# EasyEDA Pro project 第十五届蓝桥杯EDA赛项模拟试题一（嘉立创EDA提供）.eprj

# Schematic Schematic1
Create Date: 2024-01-25; Page Name: P1; Project Name: 【2024年蓝桥杯模拟试题】基于CW32的简易游戏机-EDA提供; Schematic Name: Schematic1; Update Date: 2024-01-25; Company: 深圳嘉立创科技集团股份有限公司; Drawed: 嘉立创EDA; Page Size: A4; Part Number: JLC-PCB-002; Reviewed: 嘉立创EDA; Version: V1.0
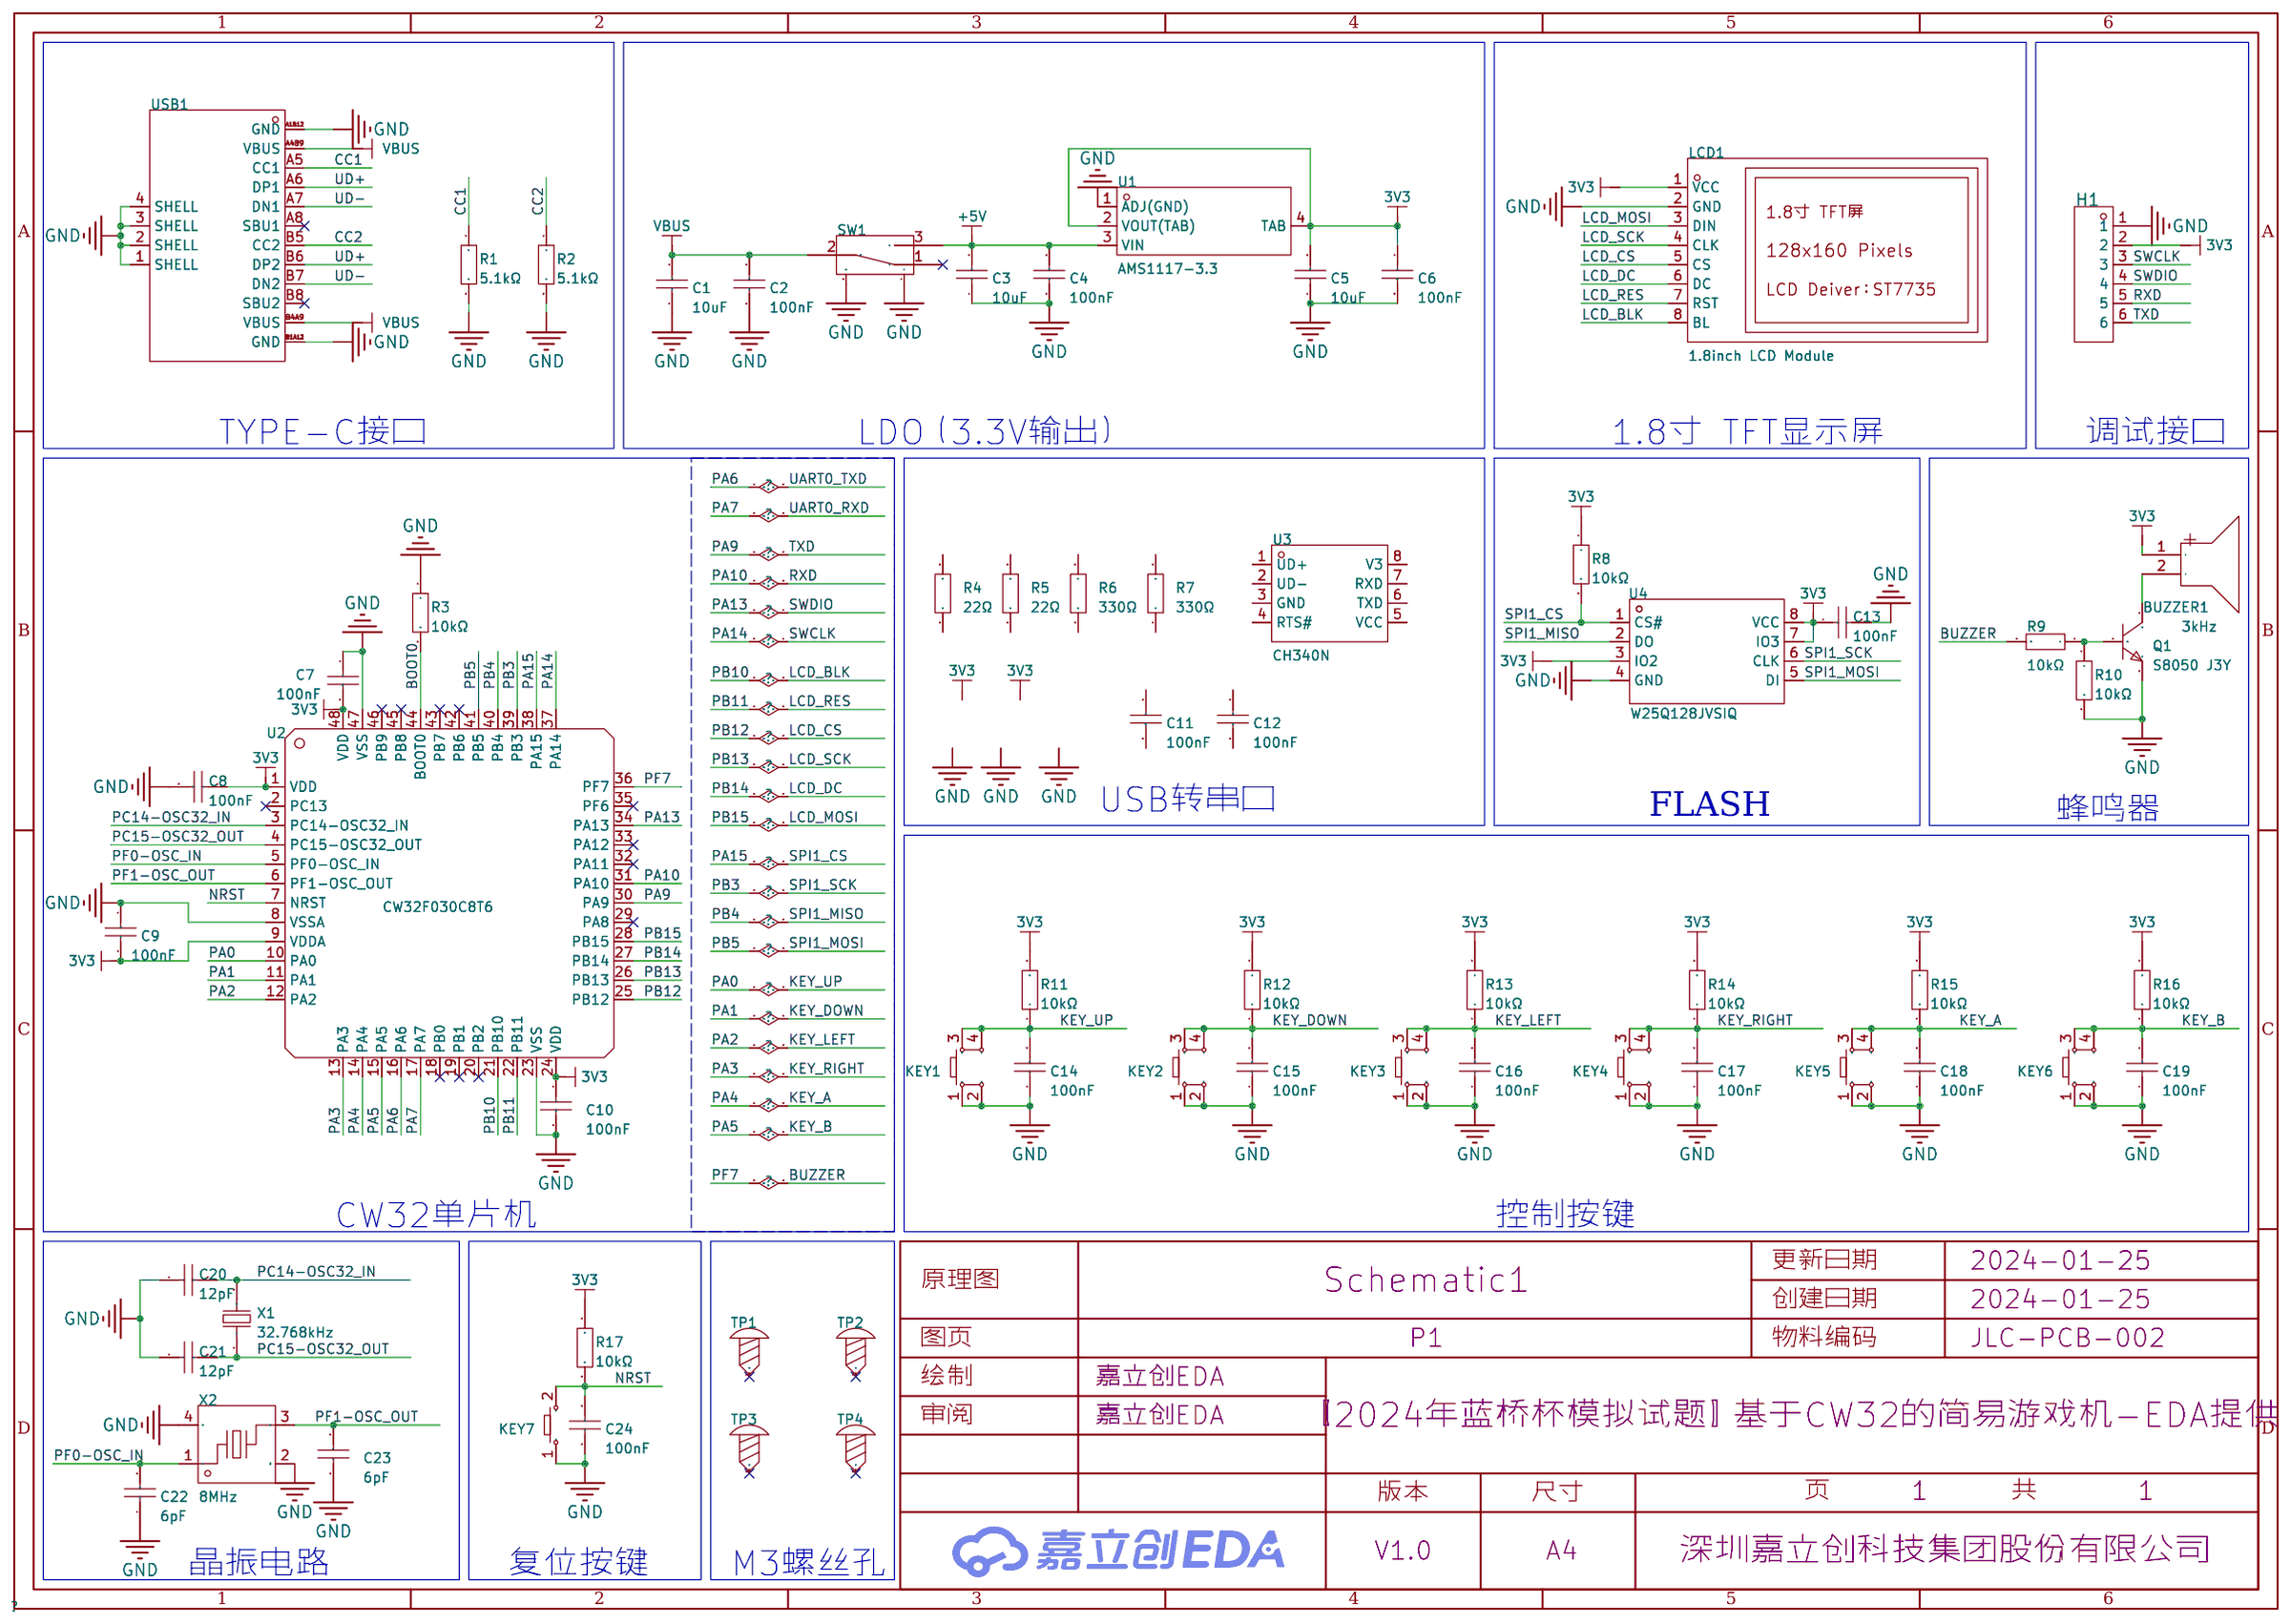
[diagram p0: schematic sheet]

## Parts
BUZZER1  3kHz  [BUZ-TH_BD9.0-P5.00-D0.6-FD]
C1  10uF  [C0805]
C2  100nF  [C0805]
C3  10uF  [C0805]
C4  100nF  [C0805]
C5  10uF  [C0805]
C6  100nF  [C0805]
C7  100nF  [C0805]
C8  100nF  [C0805]
C9  100nF  [C0805]
C10  100nF  [C0805]
C11  100nF  [C0805]
C12  100nF  [C0805]
C13  100nF  [C0805]
C14  100nF  [C0805]
C15  100nF  [C0805]
C16  100nF  [C0805]
C17  100nF  [C0805]
C18  100nF  [C0805]
C19  100nF  [C0805]
C20  12pF  [C0805]
C21  12pF  [C0805]
C22  6pF  [C0805]
C23  6pF  [C0805]
C24  100nF  [C0805]
H1  PZ254V-11-06P  [HDR-TH_6P-P2.54-V-M]
KEY1  -  [SW-SMD_4P-L6.0-W6.0-P4.50-LS9.0-2]
KEY2  -  [SW-SMD_4P-L6.0-W6.0-P4.50-LS9.0-2]
KEY3  -  [SW-SMD_4P-L6.0-W6.0-P4.50-LS9.0-2]
KEY4  -  [SW-SMD_4P-L6.0-W6.0-P4.50-LS9.0-2]
KEY5  -  [SW-SMD_4P-L6.0-W6.0-P4.50-LS9.0-2]
KEY6  -  [SW-SMD_4P-L6.0-W6.0-P4.50-LS9.0-2]
KEY7  -  [Key_SMD_3.6x6.1x2.5]
LCD1  1.8inch LCD Module  [LCD-TH_L56.5-W34.0_1-8INCH-LCD-MODULE]
Q1  S8050 J3Y  [SOT-23-3_L3.0-W1.7-P0.95-LS2.9-BR]
R1  5.1kΩ  [R0805]
R2  5.1kΩ  [R0805]
R3  10kΩ  [R0805]
R4  22Ω  [R0805]
R5  22Ω  [R0805]
R6  330Ω  [R0805]
R7  330Ω  [R0805]
R8  10kΩ  [R0805]
R9  10kΩ  [R0805]
R10  10kΩ  [R0805]
R11  10kΩ  [R0805]
R12  10kΩ  [R0805]
R13  10kΩ  [R0805]
R14  10kΩ  [R0805]
R15  10kΩ  [R0805]
R16  10kΩ  [R0805]
R17  10kΩ  [R0805]
SW1  SK-12E12-G5  [SW-TH_SK-12E12-G5]
TP1  -  [M3螺丝]
TP2  -  [M3螺丝]
TP3  -  [M3螺丝]
TP4  -  [M3螺丝]
U1  AMS1117-3.3  [SOT-223-4_L6.5-W3.5-P2.30-LS7.0-BR]
U2  CW32F030C8T6  [LQFP-48_L7.0-W7.0-P0.50-LS9.0-TL]
U3  CH340N  [SOP-8_L4.9-W3.9-P1.27-LS6.0-BL]
U4  W25Q128JVSIQ  [SOIC-8_L5.3-W5.3-P1.27-LS8.0-BL]
USB1  TYPE-C 16PIN 3MD(385)  [USB-C-SMD_TYPE-C16PIN]
X1  32.768kHz  [FC-135R_L3.2-W1.5]
X2  8MHz  [OSC-SMD_4P-L3.2-W2.5-BL]

## Library data of the parts
BUZZER1 = HNB09A03: 驱动方式:有源(内含驱动线路);构造类型:电磁式;额定电压:3V;工作电压:1.5V~4.5V;消耗电流:30mA;频率:3kHz;声压(SPL):85dB@10cm;直径(φD):9mm;长度:-;宽度:-;高度:5.5mm;工作温度:-20℃~+70℃;; LCSC Part Name: 电磁式有源一体蜂鸣器HNB09A03; Supplier Part: C96102; Manufacturer: 华能; Supplier Footprint: 插件,D=9mm; Datasheet: https://atta.szlcsc.com/upload/public/pdf/source/20170522/1495448326172.pdf; Supplier: LCSC; Oscillator Circuit: 有源(内含驱动线路); Technology Type: 电磁式; Rated Voltage: 3V; Operating Voltage: 1.5V~4.5V; Current Consumption: 30mA; Sound Pressure Level (SPL): 85dB@10cm; Diameter (φD): 9mm; Height: 5.5mm; Operating Temperature: -20℃~+70℃
C1 C3 C5 = CL21A106KAYNNNE_C15850: 容值:10uF;精度:±10%;额定电压:25V;材质(温度系数):X5R;; LCSC Part Name: 10uF ±10% 25V; Supplier Part: C15850; Manufacturer: SAMSUNG(三星); Manufacturer Part: CL21A106KAYNNNE; Supplier Footprint: 0805; Datasheet: https://atta.szlcsc.com/upload/public/pdf/source/20160103/1457707679302.pdf; Supplier: LCSC; Tolerance: ±10%; Voltage Rated: 25V; Temperature Coefficient: X5R
C2 C4 C6-C19 C24 = CL21B104KBCNNNC: 容值:100nF;精度:±10%;额定电压:50V;材质(温度系数):X7R;; LCSC Part Name: 100nF ±10% 50V; Supplier Part: C1711; Manufacturer: SAMSUNG(三星); Supplier Footprint: 0805; Datasheet: https://atta.szlcsc.com/upload/public/pdf/source/20160218/1457707763339.pdf; Supplier: LCSC; Tolerance: ±10%; Voltage Rated: 50V; Temperature Coefficient: X7R
C20 C21 = 0805CG120J500NT: 容值:12pF;精度:±5%;额定电压:50V;材质(温度系数):C0G;; LCSC Part Name: 12pF ±5% 50V; Supplier Part: C1792; Manufacturer: FH(风华); Supplier Footprint: 0805; Datasheet: https://atta.szlcsc.com/upload/public/pdf/source/20200305/C486355_26A10D38EF8C2A5C37091D0039909270.pdf; Supplier: LCSC; Tolerance: ±5%; Voltage Rated: 50V; Temperature Coefficient: C0G
C22 C23 = 0805CG6R0C500NT: 容值:6pF;额定电压:50V;材质(温度系数):C0G;; LCSC Part Name: 6pF 50V ±0.25pF; Supplier Part: C67560; Manufacturer: FH(风华); Supplier Footprint: 0805; JLCPCB Part Class: 扩展库; Datasheet: https://atta.szlcsc.com/upload/public/pdf/source/20200305/C486355_26A10D38EF8C2A5C37091D0039909270.pdf; Supplier: LCSC; Voltage Rated: 50V; Temperature Coefficient: C0G
H1 = PZ254V-11-06P: 排数:单排;总PIN位数:6;间距:2.54mm;插针结构:1x6P;行距:-;安装类型:直插;圆针/方针:方针;额定电流:-;额定电压:-;配合针长度:6mm;塑高:2.5mm;端接针长度:3mm;触头材质:黄铜;触头镀层:-;工作温度范围:-40℃~+105℃;颜色:黑色;; LCSC Part Name: 2.54mm 1x6P 直插 方针; Supplier Part: C492405; Manufacturer: XFCN(兴飞); Supplier Footprint: 直插,P=2.54mm; JLCPCB Part Class: 扩展库; Supplier: LCSC; Number of Rows: 单排; Number of Pins: 6; Pitch: 2.54mm; Pin Structure: 1x6P; Mounting Type: 直插; Circluar Pins/Square Pins: 方针; Length of Mating Pin: 6mm; Insulation Height: 2.5mm; Length of End Connection Pin: 3mm; Contact Material: 黄铜; Operating Temperature Range: -40℃~+105℃; Color: 黑色
KEY1-KEY6 = Key_SMD_6x6x6.5: Supplier Footprint: SMD
KEY7 = Key_SMD_3.6x6.1x2.5: Supplier Footprint: SMD
LCD1 = 1.8inch LCD Module: 主控芯片:ST7735S;尺寸(inch):1.8;; LCSC Part Name: 树莓派 1.8寸LCD 迷你显示屏 扩展板 SPI接口 支持Arduino; Supplier Part: C359940; Manufacturer: Waveshare(微雪电子); Datasheet: https://atta.szlcsc.com/upload/public/pdf/source/20190107/C359940_B08D95A5D16FFF3D67403C4EC320696B.pdf; Supplier: LCSC; Main Control Chip: ST7735S; Size: 1.8
Q1 = S8050 J3Y_C2146: 晶体管类型:NPN;集射极击穿电压(Vceo):25V;集电极电流(Ic):500mA;功率(Pd):300mW;直流电流增益(hFE@Ic,Vce):200@50mA,1V;; LCSC Part Name: NPN 25V 500mA (200-350); Supplier Part: C2146; Manufacturer: CJ(江苏长电/长晶); Supplier Footprint: SOT-23; Datasheet: https://atta.szlcsc.com/upload/public/pdf/source/20140809/1457707209234.pdf; Supplier: LCSC; Transistor Type: NPN; Collector-Emitter Breakdown Voltage (Vceo): 25V; Collector Current (Ic): 500mA; Power Dissipation (Pd): 300mW; Collector Cut-Off Current (Icbo): 100nA; Collector-Emitter Saturation Voltage (VCE(sat)@Ic,Ib): 600mV@500mA,50mA; DC Current Gain (hFE@Ic,Vce): 200@50mA,1V; Transition Frequency (fT): 150MHz; Operating Temperature: +150℃@(Tj)
R1 R2 = 0805W8F5101T5E: 阻值:5.1kΩ;精度:±1%;功率:125mW;温度系数:±100ppm/℃;电阻类型:厚膜电阻;; LCSC Part Name: 5.1kΩ ±1% 125mW 厚膜电阻; Supplier Part: C27834; Manufacturer: UNI-ROYAL(厚声); Supplier Footprint: 0805; JLCPCB Part Class: 基础库; Datasheet: https://atta.szlcsc.com/upload/public/pdf/source/20200306/C422600_1E6D84923E4A46A82E41ADD87F860B5C.pdf; Supplier: LCSC; Tolerance: ±1%; Power(Watts): 125mW; Overload Voltage (Max): 150V; Temperature Coefficient: ±100ppm/℃; Type: 厚膜电阻; Operating Temperature Range: -55℃~+155℃
R3 R8-R17 = 0805W8F1002T5E_C17414: 阻值:10kΩ;精度:±1%;功率:125mW;温度系数:±100ppm/℃;电阻类型:厚膜电阻;; LCSC Part Name: 10kΩ ±1% 125mW 厚膜电阻; Supplier Part: C17414; Manufacturer: UNI-ROYAL(厚声); Manufacturer Part: 0805W8F1002T5E; Supplier Footprint: 0805; Datasheet: https://atta.szlcsc.com/upload/public/pdf/source/20200306/C422600_1E6D84923E4A46A82E41ADD87F860B5C.pdf; Supplier: LCSC; Tolerance: ±1%; Power(Watts): 125mW; Overload Voltage (Max): 150V; Temperature Coefficient: ±100ppm/℃; Type: 厚膜电阻; Operating Temperature Range: -55℃~+155℃
R4 R5 = 0805W8F220JT5E: 阻值:22Ω;精度:±1%;功率:125mW;温度系数:±100ppm/℃;电阻类型:厚膜电阻;; LCSC Part Name: 22Ω ±1% 125mW 厚膜电阻; Supplier Part: C17561; Manufacturer: UNI-ROYAL(厚声); Supplier Footprint: 0805; JLCPCB Part Class: 基础库; Datasheet: https://atta.szlcsc.com/upload/public/pdf/source/20200306/C422600_1E6D84923E4A46A82E41ADD87F860B5C.pdf; Supplier: LCSC; Tolerance: ±1%; Power(Watts): 125mW; Overload Voltage (Max): 150V; Temperature Coefficient: ±100ppm/℃; Type: 厚膜电阻; Operating Temperature Range: -55℃~+155℃
R6 R7 = 0805W8F3300T5E: 阻值:330Ω;精度:±1%;功率:125mW;温度系数:±100ppm/℃;电阻类型:厚膜电阻;; LCSC Part Name: 330Ω ±1% 125mW 厚膜电阻; Supplier Part: C17630; Manufacturer: UNI-ROYAL(厚声); Supplier Footprint: 0805; JLCPCB Part Class: 基础库; Datasheet: https://atta.szlcsc.com/upload/public/pdf/source/20200306/C422600_1E6D84923E4A46A82E41ADD87F860B5C.pdf; Supplier: LCSC; Tolerance: ±1%; Power(Watts): 125mW; Overload Voltage (Max): 150V; Temperature Coefficient: ±100ppm/℃; Type: 厚膜电阻; Operating Temperature Range: -55℃~+155℃
SW1 = SK-12E12-G5: 额定电流(DC):-;额定电压(DC):-;额定电流(AC):-;额定电压(AC):-;电路结构:单刀双掷;安装方式:卧插;机械寿命:5千次;; LCSC Part Name: 卧插双档 滑动开关; Supplier Part: C136720; Manufacturer: 韩国韩荣; Supplier Footprint: 插件; JLCPCB Part Class: 扩展库; Datasheet: https://atta.szlcsc.com/upload/public/pdf/source/20210810/880D64C2F8CCE477762EFCC00B7B7681.pdf; Supplier: LCSC; Circuit: 单刀双掷; Mounting Style: 卧插; Mechanical Life: 5千次; Actuator Style: 矩形柱状; Pin Style: PC引脚; Operating Temperature: -25℃~+70℃; Switch Height: 10.6mm
TP1-TP4 = M3螺丝: Supplier Footprint: 插件
U1 = AMS1117-3.3_C347222: 输出类型:固定;最大输入电压:18V;输出电压:3.3V;输出电流:1A;电源纹波抑制比(PSRR):60dB@(120Hz);输出极性:正;; LCSC Part Name: 输入18V 输出3.3V 1A; Supplier Part: C347222; Manufacturer: UMW(友台半导体); Supplier Footprint: SOT-223; JLCPCB Part Class: 扩展库; Datasheet: https://atta.szlcsc.com/upload/public/pdf/source/20231109/155D79A26D9DB04352555A58D5969DC8.pdf; Supplier: LCSC; Output Type: 固定; Maximum Input Voltage: 18V; Output Voltage: 3.3V; Output Current: 1A; Power Supply Rejection Ratio (PSRR): 60dB@(120Hz); Dropout Voltage: 1.3V@(1A); Output Polarity: 正; Number of Outputs: 1
U2 = CW32F030C8T6_C3019113: CPU内核:ARM-M系列;CPU最大主频:64MHz;程序存储容量:-;程序存储器类型:-;GPIO端口数量:39;工作电压范围:1.65V~5.5V;RAM总容量:8KB;; Supplier Part: C3019113; Manufacturer: CW(芯源); Supplier Footprint: LQFP-48(7x7); Datasheet: https://atta.szlcsc.com/upload/public/pdf/source/20220516/D60F5E1023A73FFF550D4A77416DDFBC.pdf; Supplier: LCSC; CPU Core: ARM-M系列; CPU Maximum Speed: 64MHz; GPIO Ports Number: 39; Operating Voltage Range: 1.65V~5.5V; RAM Size: 8KB; Operating Temperature Range: -40℃~+105℃; ADC (Bit): 12bit; 16Bit Timer: 8; UART/USART: 3; I2C: 2; SPI: 2; Internal Comparator: 有; Peripheral/Function: 片载温度传感器；DMA；看门狗；低电压检测；CRC校验; Watchdog: 有; Low-Voltage Detect: 有; Direct Memory Access: 有
U3 = CH340N: LCSC Part Name: USB转串口芯片 CH340; Supplier Part: C2977777; Manufacturer: WCH(南京沁恒); Supplier Footprint: SOP-8; JLCPCB Part Class: 扩展库; Datasheet: https://atta.szlcsc.com/upload/public/pdf/source/20230530/6E401E9554E9F5311886CC8B3F89B62E.pdf; Supplier: LCSC
U4 = W25Q128JVSIQ: 接口类型:-;存储容量:128Mbit;时钟频率(fc):-;; LCSC Part Name: W25Q128JVSIQ 编带; Supplier Part: C97521; Manufacturer: WINBOND(华邦); Supplier Footprint: SOP-8-208mil; JLCPCB Part Class: 基础库; Datasheet: https://atta.szlcsc.com/upload/public/pdf/source/20170316/1489627409956.pdf; Supplier: LCSC; Memory Size: 128Mbit
USB1 = TYPE-C 16PIN 3MD(385): 连接器类型:Type-C;标准:-;公母:母;端口数量:1;触点数量:16P;安装方式:卧贴;额定电流 - 电源:3A;工作温度范围:-40℃~+85℃;; LCSC Part Name: Type-C 母 卧贴; Supplier Part: C2858270; Manufacturer: SHOU HAN(首韩); Supplier Footprint: SMD; JLCPCB Part Class: Extended Part; Datasheet: https://atta.szlcsc.com/upload/public/pdf/source/20211123/39B17C16241EAC15C5E277BDA434118E.pdf; Supplier: LCSC; Connector Type: Type-C; Gender: 母; Number of Ports: 1; Number of Contacts: 16P; Mounting Style: 卧贴; Current Rating - Power (Max): 3A; Operating Temperature Range: -40℃~+85℃
X1 = Q13FC1350000400: 频率:32.768kHz;负载电容:12.5pF;频率公差:±20ppm;; LCSC Part Name: 32.768kHz ±20ppm 12.5pF; Supplier Part: C32346; Manufacturer: EPSON(爱普生); Supplier Footprint: SMD3215-2P; Datasheet: https://atta.szlcsc.com/upload/public/pdf/source/20190108/C32346_746D6B07EAF90824457A96480007685F.pdf; Supplier: LCSC; Crystal Type: 贴片无源晶振; Load Capacitance: 12.5pF; Equivalent Series Resistance (ESR): 70kΩ; Frequency Tolerance: ±20ppm; Operating Temperature: -40℃~+85℃
X2 = X32258MOB4SI: 晶振类型:贴片无源晶振;频率:8MHz;常温频差:±10ppm;负载电容:12pF;频率稳定度(全温):±30ppm;; LCSC Part Name: 8MHz ±10ppm 12pF; Supplier Part: C2682775; Manufacturer: YXC(扬兴晶振); Supplier Footprint: SMD3225-4P; JLCPCB Part Class: 扩展库; Datasheet: https://atta.szlcsc.com/upload/public/pdf/source/20210106/C2682774_0CD4FDA5D9DA3FBEEC23BD607A48E4B0.pdf; Supplier: LCSC; Crystal Type: 贴片无源晶振; Normal temperature Frequency Tolerance: ±10ppm; Load Capacitance: 12pF; Frequency Stability(Full temperature range): ±30ppm; Equivalent Series Resistance (ESR): 150Ω; Operating Temperature: -40℃~+85℃

## Nets
3V3: BUZZER1.1(+) C5.2 C6.1 C7.2 C8.1 C9.2 C10.1 C13.1 H1.2 LCD1.1(VCC) R8.1 R11.2 R12.2 R13.2 R14.2 R15.2 R16.2 R17.2 U1.2(VOUT(TAB)) U1.4(TAB) U2.1(VDD) U2.9(VDDA) U2.24(VDD) U2.48(VDD) U4.3(IO2) U4.7(IO3) U4.8(VCC)
+5V: C3.2 C4.1 SW1.3 U1.3(VIN)
GND: C1.1 C2.2 C3.1 C4.2 C5.1 C6.2 C7.1 C8.2 C9.1 C10.2 C13.2 C14.1 C15.1 C16.1 C17.1 C18.1 C19.1 C20.1 C21.1 C22.1 C23.1 C24.1 H1.1 KEY1.1 KEY1.2 KEY2.1 KEY2.2 KEY3.1 KEY3.2 KEY4.1 KEY4.2 KEY5.1 KEY5.2 KEY6.1 KEY6.2 KEY7.1 LCD1.2(GND) Q1.2(E) R1.2 R2.2 R3.1 R10.2 SW1.4 SW1.5 U1.1(ADJ(GND)) U2.8(VSSA) U2.23(VSS) U2.47(VSS) U4.4(GND) USB1.1(SHELL) USB1.2(SHELL) USB1.3(SHELL) USB1.4(SHELL) USB1.A1B12(GND) USB1.B1A12(GND) X2.2(GND) X2.4(GND)
VBUS: C1.2 C2.1 SW1.2 USB1.A4B9(VBUS) USB1.B4A9(VBUS)
BOOT0: R3.2 U2.44(BOOT0)
BUZZER: R9.2 U2.36(PF7)
CC1: R1.1 USB1.A5(CC1)
CC2: R2.1 USB1.B5(CC2)
KEY_A: C18.2 KEY5.3 KEY5.4 R15.1 U2.14(PA4)
KEY_B: C19.2 KEY6.3 KEY6.4 R16.1 U2.15(PA5)
KEY_DOWN: C15.2 KEY2.3 KEY2.4 R12.1 U2.11(PA1)
KEY_LEFT: C16.2 KEY3.3 KEY3.4 R13.1 U2.12(PA2)
KEY_RIGHT: C17.2 KEY4.3 KEY4.4 R14.1 U2.13(PA3)
KEY_UP: C14.2 KEY1.3 KEY1.4 R11.1 U2.10(PA0)
LCD_BLK: LCD1.8(BL) U2.21(PB10)
LCD_CS: LCD1.5(CS) U2.25(PB12)
LCD_DC: LCD1.6(DC) U2.27(PB14)
LCD_MOSI: LCD1.3(DIN) U2.28(PB15)
LCD_RES: LCD1.7(RST) U2.22(PB11)
LCD_SCK: LCD1.4(CLK) U2.26(PB13)
NRST: C24.2 KEY7.2 R17.1 U2.7(NRST)
PA6: U2.16(PA6)
PA7: U2.17(PA7)
PA9: H1.6 U2.30(PA9)
PA10: H1.5 U2.31(PA10)
PA13: H1.4 U2.34(PA13)
PA14: H1.3 U2.37(PA14)
PA15: R8.2 U2.38(PA15) U4.1(CS#)
PB3: U2.39(PB3) U4.6(CLK)
PB4: U2.40(PB4) U4.2(DO)
PB5: U2.41(PB5) U4.5(DI)
PC14-OSC32_IN: C20.2 U2.3(PC14-OSC32_IN) X1.2
PC15-OSC32_OUT: C21.2 U2.4(PC15-OSC32_OUT) X1.1
PF0-OSC_IN: C22.2 U2.5(PF0-OSC_IN) X2.1
PF1-OSC_OUT: C23.2 U2.6(PF1-OSC_OUT) X2.3
UD+: USB1.A6(DP1) USB1.B6(DP2)
UD-: USB1.A7(DN1) USB1.B7(DN2)
Net-(BUZZER1-2): BUZZER1.2(-) Q1.3(C)
Net-(Q1-1): Q1.1(B) R9.1 R10.1

Not connected (* = marked no-connect by the designer): C11 1 2; C12 1 2; R4 1 2; R5 1 2; R6 1 2; R7 1 2; SW1 1*; TP1 1*; TP2 1*; TP3 1*; TP4 1*; U2 2(PC13)* 18(PB0)* 19(PB1)* 20(PB2)* 29(PA8)* 32(PA11)* 33(PA12)* 35(PF6)* 42(PB6)* 43(PB7)* 45(PB8)* 46(PB9)*; U3 1(UD+) 2(UD-) 3(GND) 4(RTS#) 5(VCC) 6(TXD) 7(RXD) 8(V3); USB1 A8(SBU1)* B8(SBU2)*

## Notes on the sheet
- TYPE-C接口
- LDO（3.3V输出）
- 1.8寸 TFT显示屏
- 调试接口
- USB转串口
- FLASH
- 蜂鸣器
- CW32单片机
- 控制按键
- 晶振电路
- 复位按键
- M3螺丝孔

# Board PCB1
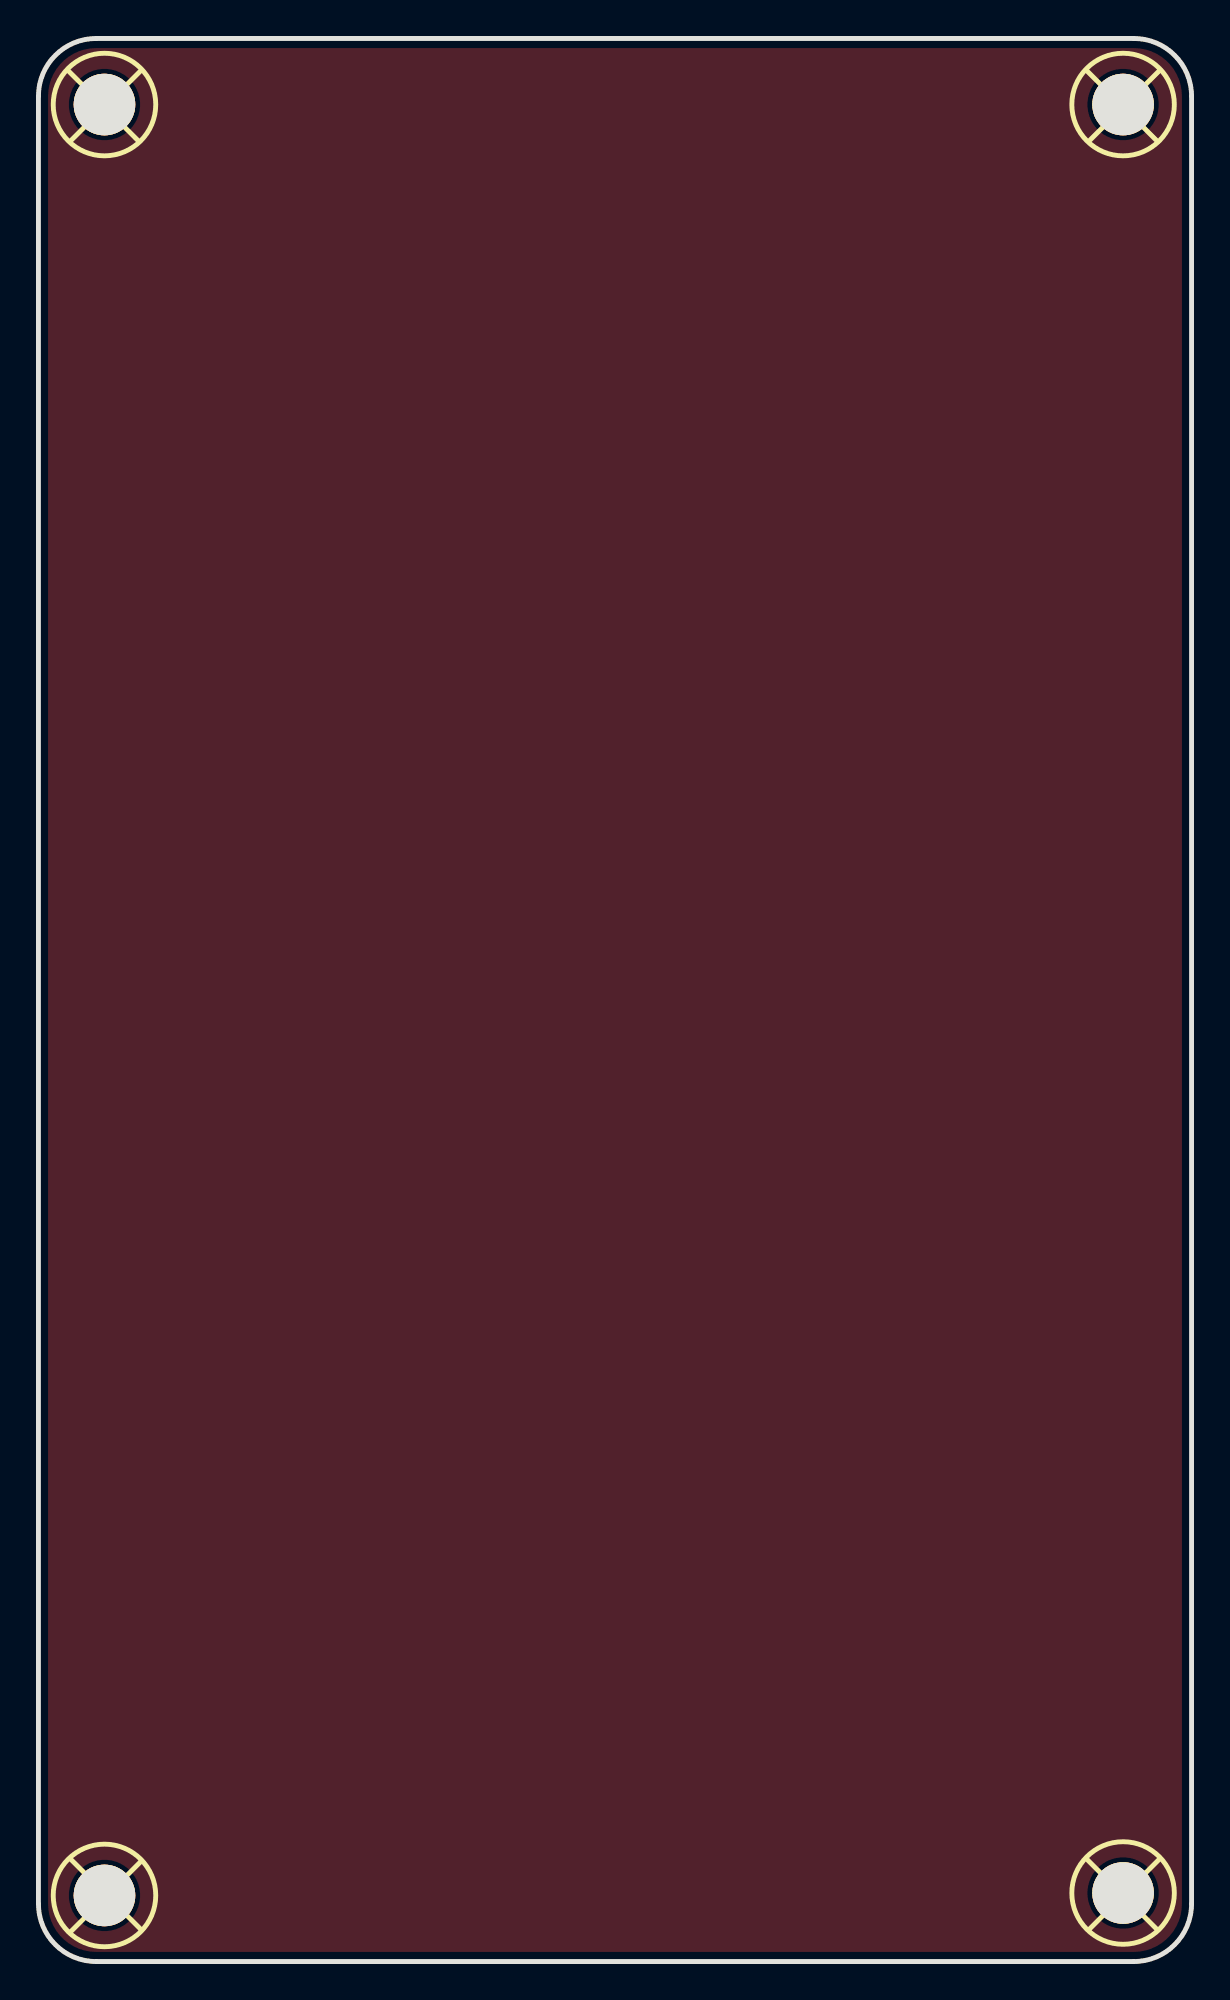
[diagram p1: board, top side]
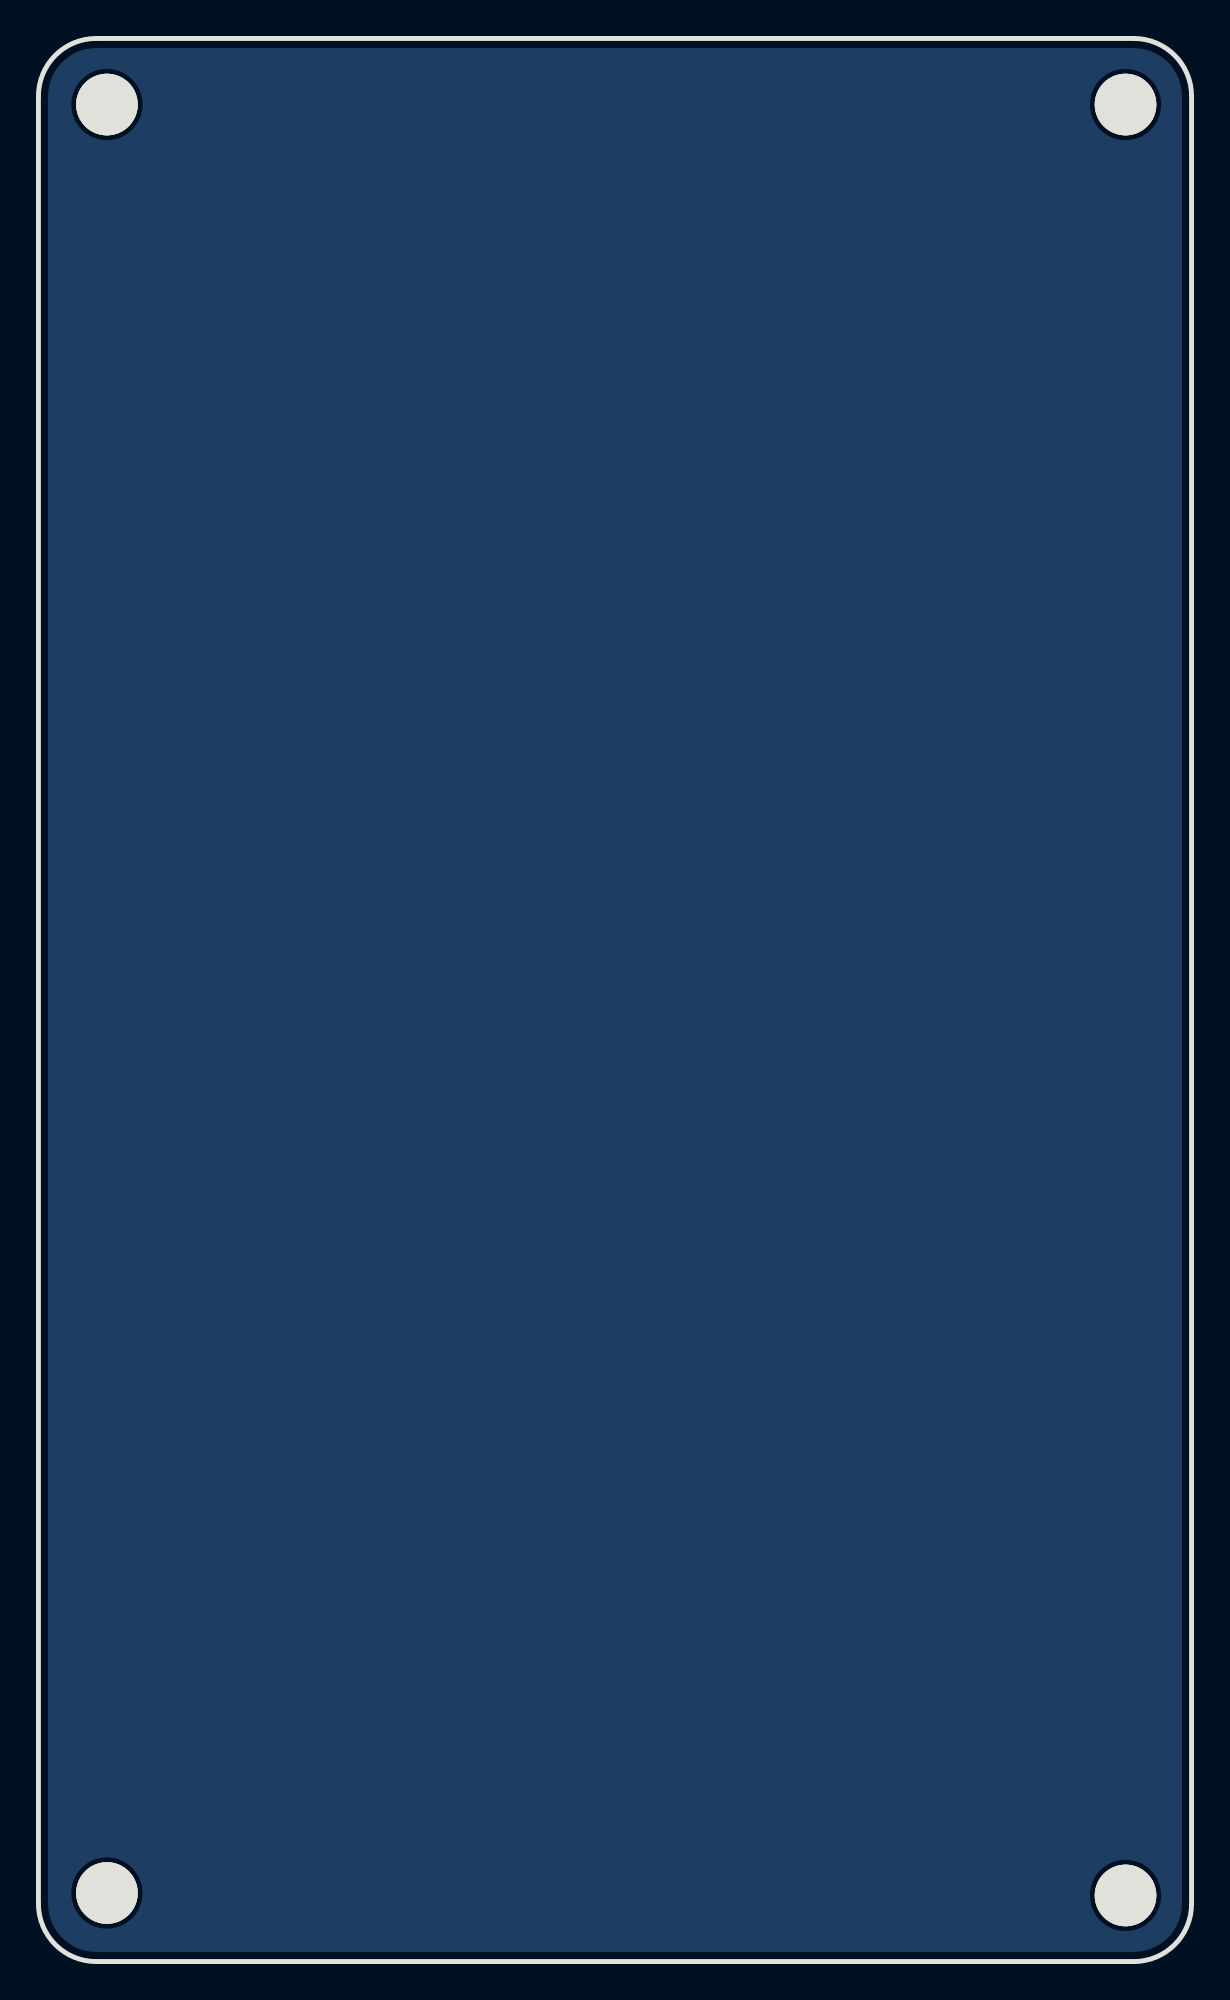
[diagram p2: board, bottom side, seen from below]

Outline 60 x 100 mm; copper layers: Top Layer, Bottom Layer. Coordinates in mm from the lower left corner of the outline.
Outline path: 0,97 0,3 arc(0.88,0.88) 3,0 57,0 arc(59.12,0.88) 60,3 60,97 arc(59.12,99.12) 57,100 3,100 arc(0.88,99.12) 0,97
Stack: Top Layer 0.035mm / Dielectric1 1.51mm FR4 er 4.5 / Bottom Layer 0.035mm

## Design rules (mm)
template: JLCPCB Capability(Two Layers Board)
spacing copperThickness1oz (default): track to track 0.102, other pairs 0.152 to 0.3
spacing copperThickness2oz: track to track 0.203, other pairs 0.152 to 0.3
track width copperThickness1oz (default): min 0.127, default 0.254, max 2.54
track width copperThickness2oz: min 0.203, default 0.254, max 2.54
differential pair differentialPair (default): width min 0.127, default 0.254, max 2.54; gap min 0.152, default 0.152
via viaSize (default): diameter min 0.5, default 0.61, max 10; hole min 0.3, default 0.305, max 6.3

## Placement (name value [footprint] x y rotation side)
TP1  -  [M3螺丝]  3.5 3.5 90 top
TP2  -  [M3螺丝]  3.5 96.5 0 top
TP3  -  [M3螺丝]  56.5 96.5 0 top
TP4  -  [M3螺丝]  56.5 3.5 0 top

## Footprints (pads in the part's own frame, mm; a bottom-side part is the same pattern mirrored in y, then rotated)
M3螺丝
  round 3.2 hole 3.2: 1(-0.064,0.064)

## Nets
As in the schematic.

Pads without a net: TP1 1; TP2 1; TP3 1; TP4 1

## Copper pours and planes (outline as drawn; the poured copper is in the pictures)
GND on Top Layer: 0,97 0.01,97.26 0.06,97.61 0.15,97.94 0.28,98.27 0.45,98.57 0.65,98.86 0.88,99.12 1.14,99.35 1.43,99.55 1.73,99.72 2.06,99.85 2.39,99.94 2.74,99.99 3,100 57,100 57.26,99.99 57.61,99.94 57.94,99.85 58.27,99.72 58.57,99.55 58.86,99.35 59.12,99.12 59.35,98.86 59.55,98.57 59.72,98.27 59.85,97.94 59.94,97.61 59.99,97.26 60,97 60,3 59.99,2.74 59.94,2.39 59.85,2.06 59.72,1.73 59.55,1.43 59.35,1.14 59.12,0.88 58.86,0.65 58.57,0.45 58.27,0.28 57.94,0.15 57.61,0.06 57.26,0.01 57,0 3,0 2.74,0.01 2.39,0.06 2.06,0.15 1.73,0.28 1.43,0.45 1.14,0.65 0.88,0.88 0.65,1.14 0.45,1.43 0.28,1.73 0.15,2.06 0.06,2.39 0.01,2.74 0,3
GND on Bottom Layer: 0,97 0.01,97.26 0.06,97.61 0.15,97.94 0.28,98.27 0.45,98.57 0.65,98.86 0.88,99.12 1.14,99.35 1.43,99.55 1.73,99.72 2.06,99.85 2.39,99.94 2.74,99.99 3,100 57,100 57.26,99.99 57.61,99.94 57.94,99.85 58.27,99.72 58.57,99.55 58.86,99.35 59.12,99.12 59.35,98.86 59.55,98.57 59.72,98.27 59.85,97.94 59.94,97.61 59.99,97.26 60,97 60,3 59.99,2.74 59.94,2.39 59.85,2.06 59.72,1.73 59.55,1.43 59.35,1.14 59.12,0.88 58.86,0.65 58.57,0.45 58.27,0.28 57.94,0.15 57.61,0.06 57.26,0.01 57,0 3,0 2.74,0.01 2.39,0.06 2.06,0.15 1.73,0.28 1.43,0.45 1.14,0.65 0.88,0.88 0.65,1.14 0.45,1.43 0.28,1.73 0.15,2.06 0.06,2.39 0.01,2.74 0,3
